# Altium schematic sheet 电源板.SchDoc
size A4
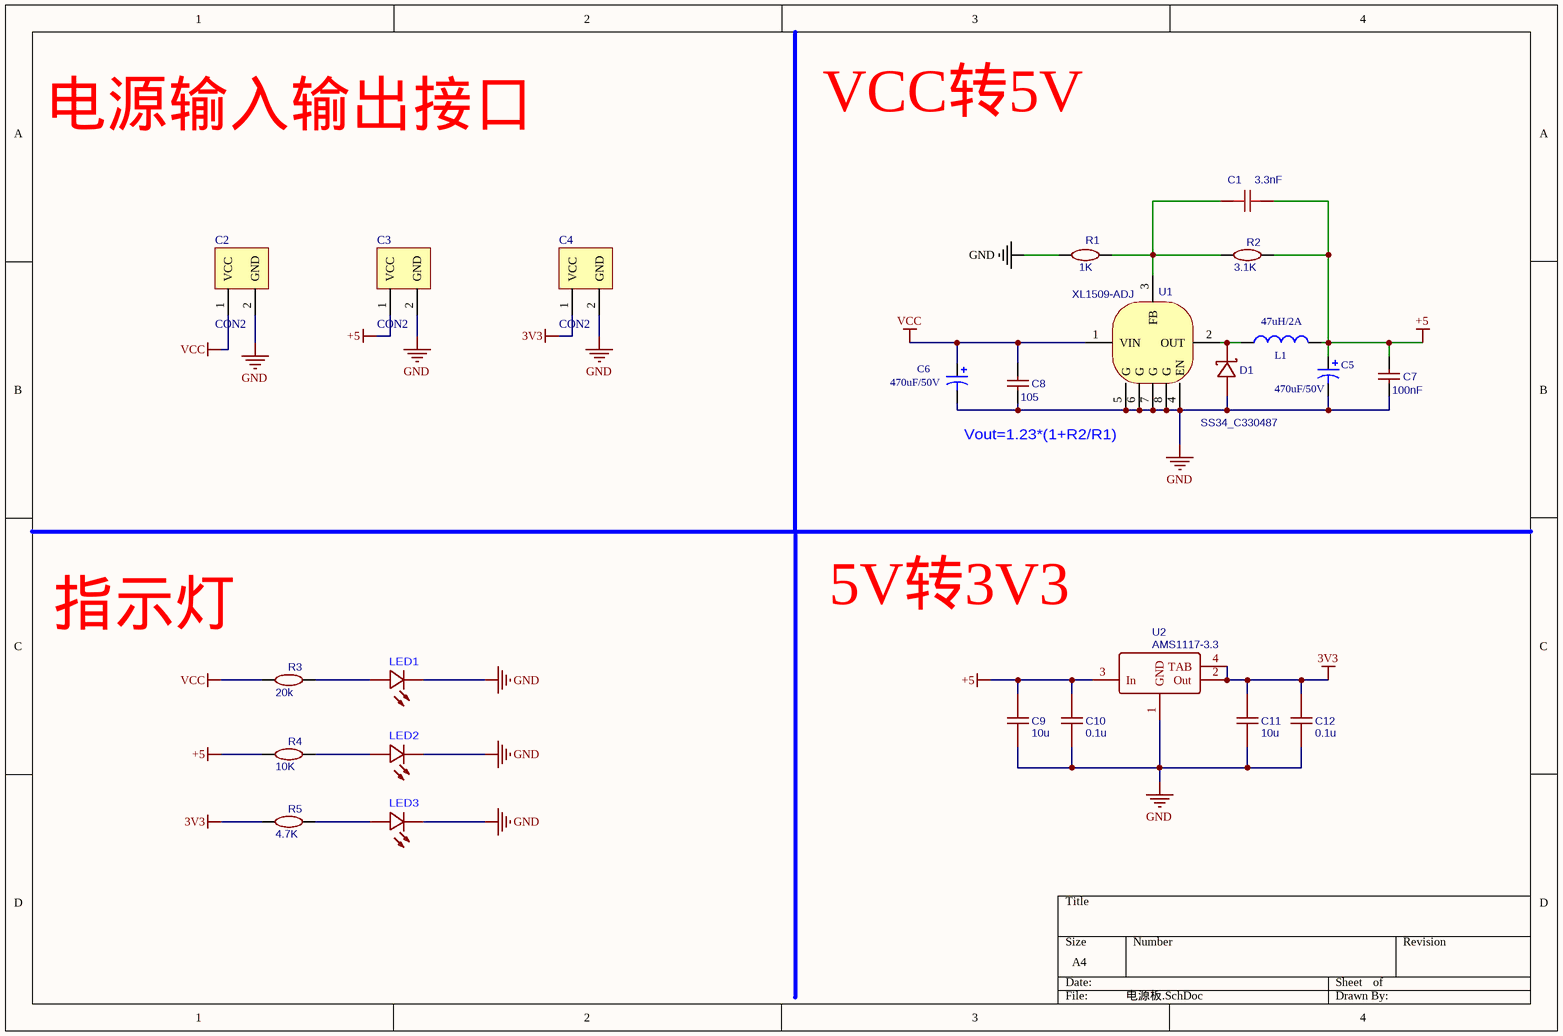
[diagram p0: 电源板.SchDoc]

## Parts
C1  3.3nF  [C0603]
C2  CON2  [CONN-TH_2P-P3.96_3961S-2P]
C3  CON2  [CONN-TH_2P-P3.96_3961S-2P]
C4  CON2  [CONN-TH_2P-P3.96_3961S-2P]
C5  470uF/50V  [CAP-SMD_BD12.5-L13.0-W13.0-LS13.7-FD]
C6  470uF/50V  [CAP-SMD_BD12.5-L13.0-W13.0-LS13.7-FD]
C7  100nF  [C0603]
C8  105  [C0603]
C9  10u  [C0603]
C10  0.1u  [C0603]
C11  10u  [C0603]
C12  0.1u  [C0603]
D1  SS34_C330487  [SMB_L4.6-W3.6-LS5.3-RD]
L1  47uH/2A  [IND-SMD_L7.1-W6.6]
LED1  (no value)  [LED0603-RD]
LED2  (no value)  [LED0603-RD]
LED3  (no value)  [LED0603-RD]
R1  1K  [0603]
R2  3.1K  [0603]
R3  20k  [0603]
R4  10K  [0603]
R5  4.7K  [0603]
U1  XL1509-ADJ  [SOP8]
U2  AMS1117-3.3  [SOT-223_L6.5-W3.5-P2.30-LS7.0-BR]

## Nets
3V3: C4.1(VCC) C11.2 C12.2 R5.1 U2.2(Out) U2.4(TAB)
+5: C1.2 C3.1(VCC) C5.1 C7.2 C9.2 C10.2 L1.2 R2.2 R4.1 U2.3(In)
GND: C2.2(GND) C3.2(GND) C4.2(GND) C5.2 C6.2 C7.1 C8.1 C9.1 C10.1 C11.1 C12.1 D1.2(A) LED1.1(-) LED2.1(-) LED3.1(-) R1.1 U1.4(EN) U1.5(G) U1.6(G) U1.7(G) U1.8(G) U2.1(GND)
VCC: C2.1(VCC) C6.1 C8.2 R3.1 U1.1(VIN)
NetC1_1: C1.1 R1.2 R2.1 U1.3(FB)
NetD1_1: D1.1(K) L1.1 U1.2(OUT)
NetLED1_2: LED1.2(+) R3.2
NetLED2_2: LED2.2(+) R4.2
NetLED3_2: LED3.2(+) R5.2

## Notes on the sheet
- 电源输入输出接口
- VCC转5V
- Vout=1.23*(1+R2/R1)
- 指示灯
- 5V转3V3

## Library data of the parts
C1 = 3.3nF: BOM_Manufacturer: Guangdong Fenghua Advanced Tech; BOM_Manufacturer Part: 0603CG332J500NT; nameAlias: Capacitance; Contributor: LCSC; BOM_Supplier: LCSC; BOM_Supplier Part: C190576; spicePre: C; spiceSymbolName: 0603CG332J500NT
C5 C6 = 470uF/35V: Published: 8-Jun-2000; LatestRevisionDate: 17-Jul-2002; LatestRevisionNote: Re-released for DXP Platform.; PackageReference: RB7.6-15; Publisher: Altium Limited; PackageDescription: Polarized Capacitor (Radial); 2 Leads
C7 C8 = 100nF: BOM_Manufacturer Part: 0603B104K160; BOM_Manufacturer: WTC; nameAlias: Capacitance; BOM_Supplier: LCSC; BOM_Supplier Part: C80516; spicePre: C; spiceSymbolName: 0603B104K160
C9 C11 = 10u: nameAlias: Value(F); Contributor: LCEDA_Lib; spicePre: C; spiceSymbolName: C_0603_US
C10 C12 = 0.1u: nameAlias: Value(F); Contributor: LCEDA_Lib; spicePre: C; spiceSymbolName: C_0603_US
D1 = SS34_C330487: BOM_Manufacturer: LGE; BOM_Manufacturer Part: SS34; Contributor: LCSC; BOM_Supplier: LCSC; BOM_Supplier Part: C330487; spicePre: D; spiceSymbolName: SS34_C330487
L1 = 47uH/2A: Code_IEC: 1005; LatestRevisionDate: 29-May-2009; LatestRevisionNote: IPC-7351 Footprint Added.; PackageReference: 0402-A; Publisher: Altium Limited; PackageDescription: Chip Inductor; Code_JEITA: 0402
LED1-LED3 = TJ-S1608CY6T5ALC6B-A5
R1 = 1K: BOM_Manufacturer Part: RC0603FR-071KL; BOM_Manufacturer: YAGEO; nameAlias: Resistance (Ohms); BOM_Supplier: LCSC; BOM_Supplier Part: C22548; spicePre: R; spiceSymbolName: RC0603FR-071KL
R2-R5 = 3.1K: BOM_Manufacturer Part: RC0603FR-071KL; BOM_Manufacturer: YAGEO; nameAlias: Resistance (Ohms); BOM_Supplier: LCSC; BOM_Supplier Part: C22548; spicePre: R; spiceSymbolName: RC0603FR-071KL
U1 = XL1509-ADJ: Contributor: XYCWJ; spicePre: U; spiceSymbolName: XL1509-ADJ
U2 = AMS1117-3.3: BOM_Manufacturer: AMS; sourceId: dwIGgezVh; SMT Type: Basic; Contributor: haohan123; timeStamp: 1476261164; BOM_Supplier: LCSC; BOM_Manufacturer Part: AMS1117-3.3; BOM_LCSC Assembly: Yes; image: //image.lceda.cn/szlcsc/C6186.jpg; BOM_Supplier Part: C6186; spicePre: U; spiceSymbolName: AMS1117-3.3